# Altium schematic sheet Mechanical.SchDoc
size A; DocumentNumber: 12; SheetNumber: 12
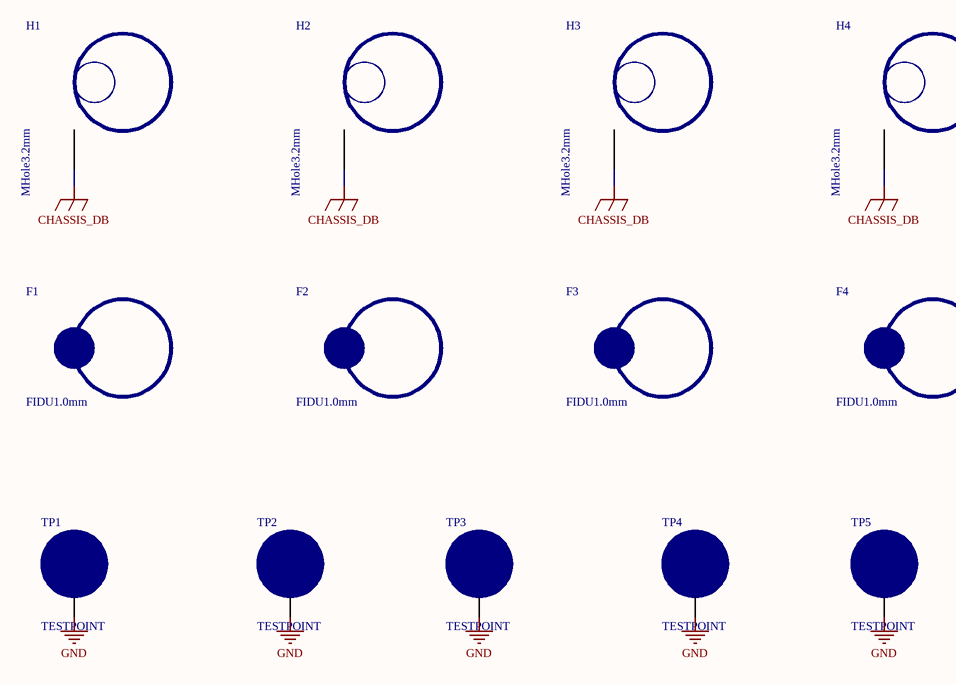
[diagram p0: Mechanical.SchDoc]

## Parts
F1  FIDU1.0mm  [FIDU1.0mm]
F2  FIDU1.0mm  [FIDU1.0mm]
F3  FIDU1.0mm  [FIDU1.0mm]
F4  FIDU1.0mm  [FIDU1.0mm]
H1  MHole3.2mm  [Mhole3.2mm - duplicate]
H2  MHole3.2mm  [Mhole3.2mm - duplicate]
H3  MHole3.2mm  [Mhole3.2mm - duplicate]
H4  MHole3.2mm  [Mhole3.2mm - duplicate]
TP1  TESTPOINT  [TESTPOINT]
TP2  TESTPOINT  [TESTPOINT]
TP3  TESTPOINT  [TESTPOINT]
TP4  TESTPOINT  [TESTPOINT]
TP5  TESTPOINT  [TESTPOINT]

## Nets
CHASSIS_DB: H1.1 H2.1 H3.1 H4.1
GND: TP1.1 TP2.1 TP3.1 TP4.1 TP5.1

## Library data of the parts
TP1-TP5 = TESTPOINT: 20-2137 1.02mm TP / FARNELL: 8731128